# Altium project DIY Air Quality Monitor.PrjPcb
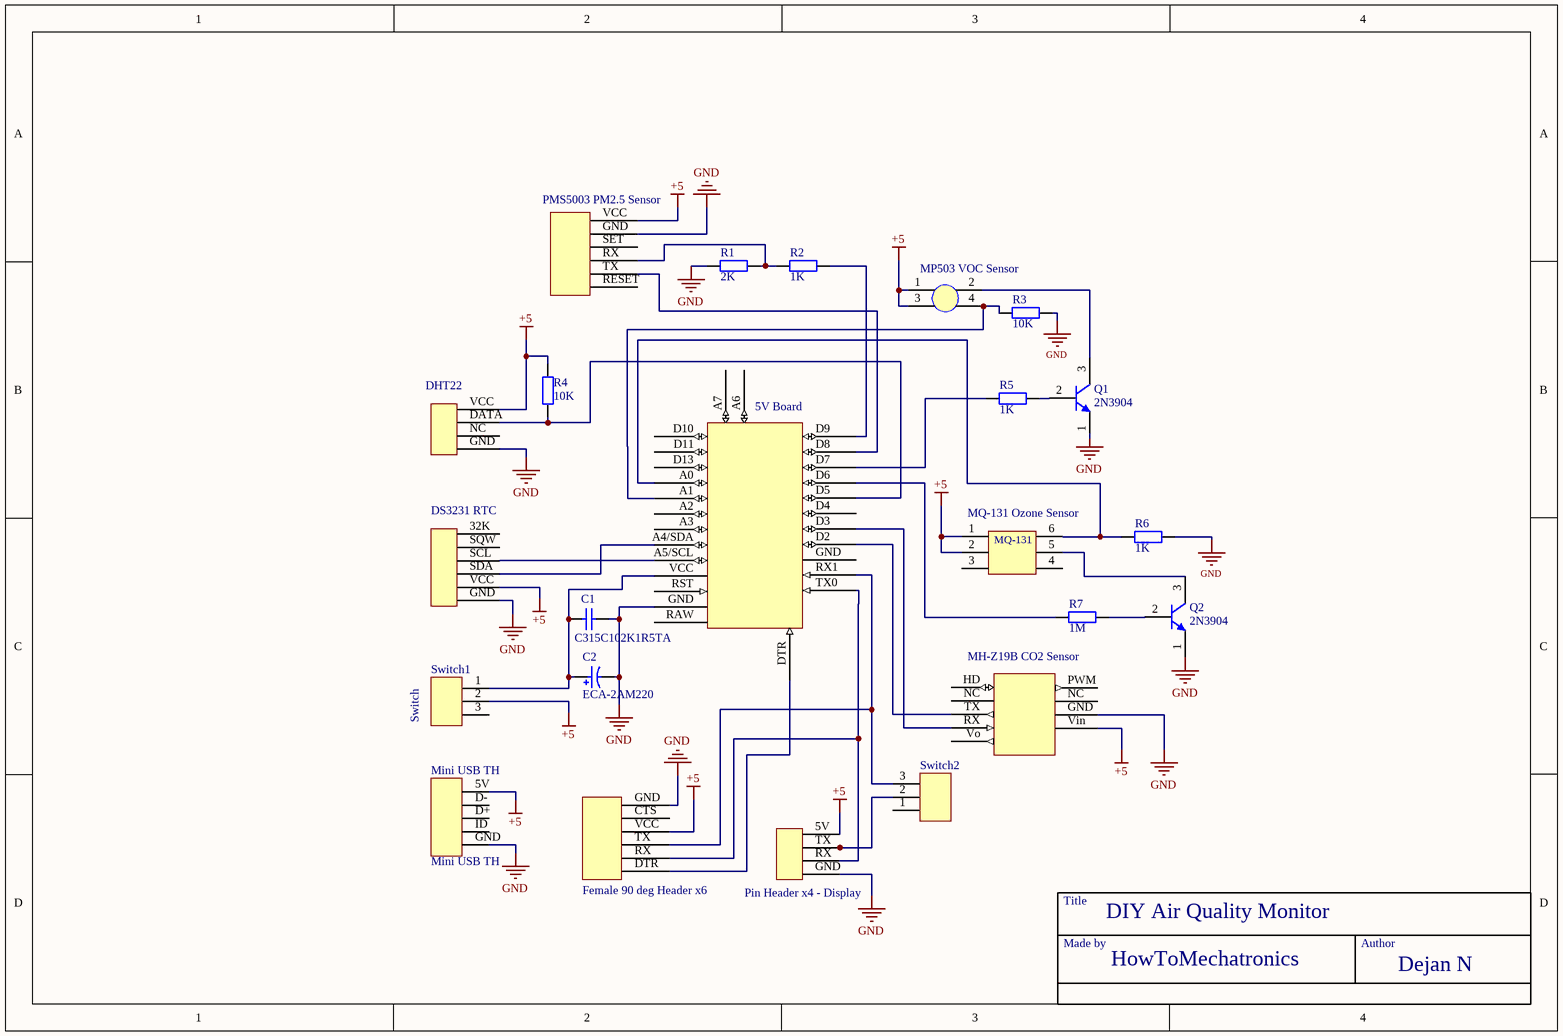
[diagram p0: DIY Air Quality Monitor.SchDoc]
1 sheet, 23 parts. Net scope: global (net labels, ports and power ports of the same name join across sheets).
Board file: DIY Air Quality Monitor.PcbDoc

## Sheet DIY Air Quality Monitor.SchDoc: DIY Air Quality Monitor
size A4; Author: Dejan; Time: DIY Air Quality Monitor

### Parts
ArduinoProMini1  5V Board  [Arduino_Pro_Mini]
C1  C315C102K1R5TA  [KEMT-C315-THT-2]
C2  ECA-2AM220  [CAPPR55-250-1120X630X1220]
DHT22  DHT22  [DHT22]
DS1  DS3231 RTC  [DS3231 RTC]
Female_90_deg_Header_x6  (no value)  [Female 90 deg Header x6]
MH-Z1  MH-Z19B CO2 Sensor  [MH-Z19B CO2 Sensor]
Mini_USB_TH  Mini USB TH  [Mini USB TH]
MP1  MP503 VOC Sensor  [MP503 VOC Sensor]
MQ-1  MQ-131 Ozone Sensor  [MQ-131 Ozone Sensor]
Pin_Header_x4_-_Display  Pin Header x4 - Display  [Pin Header x4 - Display]  (value not drawn)
PMS1  PMS5003 PM2.5 Sensor  [PMS5003 PM2.5 Sensor]
Q1  2N3904  [ONSC-TO-92-3-29-11]
Q2  2N3904  [ONSC-TO-92-3-29-11]
R1  value 2K  [AXIAL-0.4]  (hidden comment: Res2)
R2  value 1K  [AXIAL-0.4]  (hidden comment: Res2)
R3  value 10K  [AXIAL-0.4]  (hidden comment: Res2)
R4  value 10K  [AXIAL-0.4]  (hidden comment: Res2)
R5  value 1K  [AXIAL-0.4]  (hidden comment: Res2)
R6  value 1K  [AXIAL-0.4]  (hidden comment: Res2)
R7  value 1M  [AXIAL-0.4]  (hidden comment: Res2)
Switch1  Switch  [Switch]
Switch2  Switch  [Switch]  (value not drawn)

### Nets
+5: DHT22.VCC DS1.VCC Female_90_deg_Header_x6.VCC MH-Z1.Vin Mini_USB_TH.5V MP1.1 MP1.3 MQ-1.1 MQ-1.2 Pin_Header_x4_-_Display.5V PMS1.VCC R4.2 Switch1.2
GND: ArduinoProMini1.GND C1.2 C2.2 DHT22.GND DS1.GND Female_90_deg_Header_x6.GND MH-Z1.GND Mini_USB_TH.GND Pin_Header_x4_-_Display.GND PMS1.GND Q1.1(E) Q2.1(E) R1.1 R3.2 R6.2
NetArduinoProMini1_A0: ArduinoProMini1.A0 MQ-1.6 R6.1
NetArduinoProMini1_A1: ArduinoProMini1.A1 MP1.4 R3.1
NetArduinoProMini1_A4/SDA: ArduinoProMini1.A4/SDA DS1.SDA
NetArduinoProMini1_A5/SCL: ArduinoProMini1.A5/SCL DS1.SCL
NetArduinoProMini1_D2: ArduinoProMini1.D2 MH-Z1.TX
NetArduinoProMini1_D3: ArduinoProMini1.D3 MH-Z1.RX
NetArduinoProMini1_D5: ArduinoProMini1.D5 DHT22.DATA R4.1
NetArduinoProMini1_D6: ArduinoProMini1.D6 R7.1
NetArduinoProMini1_D7: ArduinoProMini1.D7 R5.1
NetArduinoProMini1_D8: ArduinoProMini1.D8 PMS1.TX
NetArduinoProMini1_D9: ArduinoProMini1.D9 R2.2
NetArduinoProMini1_DTR: ArduinoProMini1.DTR Female_90_deg_Header_x6.DTR
NetArduinoProMini1_RX1: ArduinoProMini1.RX1 Female_90_deg_Header_x6.TX Switch2.3
NetArduinoProMini1_TX0: ArduinoProMini1.TX0 Female_90_deg_Header_x6.RX Pin_Header_x4_-_Display.RX
NetArduinoProMini1_VCC: ArduinoProMini1.VCC C1.1 C2.1 Switch1.1
NetMP1_2: MP1.2 Q1.3(C)
NetMQ-1_5: MQ-1.5 Q2.3(C)
NetPin_Header_x4_-_Display_TX: Pin_Header_x4_-_Display.TX Switch2.2
NetPMS1_RX: PMS1.RX R1.2 R2.1
NetQ1_2: Q1.2(B) R5.2
NetQ2_2: Q2.2(B) R7.2

Not connected (* = marked no-connect by the designer): ArduinoProMini1 A2 A3 A6 A7 D4 D10 D11 D13 RAW RST; DHT22 NC; DS1 32K SQW; Female_90_deg_Header_x6 CTS; MH-Z1 HD NC PWM Vo; Mini_USB_TH D+ D- ID; MQ-1 3 4; PMS1 RESET SET; Switch1 3; Switch2 1

### Notes on the sheet
- Title
- DIY Air Quality Monitor
- Made by
- HowToMechatronics
- Author
- Dejan N
- (in symbol MQ-131 Ozone Sensor) MQ-131

### Library data of the parts
ArduinoProMini1 = Arduino Pro Mini Board
C1 = CMP-1664-00010-1: Capacitor, Ceramic, 1000 pF, +/-10 %, 100 V, X7R, -55 to 125 degC, 2-Pin THD, RoHS, Bulk; Max Supply Voltage: 3.6 V; Case\Package: DFN; Nominal Supply Voltage: 3 V; Min Supply Voltage: 1.5 V; Interface: Serial; ComponentLink1Description: Manufacturer URL; ComponentLink1URL: http://www.kemet.com/; DatasheetVersion: Aug-16; Max Operating Temperature: 125 degC; REACH SVHC: Unknown; Min Operating Temperature: -40 degC; Radiation Hardening: No; Mount: Surface Mount; Packaging: Tape and Reel; PackageDescription: 2-Pin Through Hole Device, Body 3.81 x 2.54 mm; RoHSCompliant: true; PackageReference: C315-THT-2; ComponentLink2URL: http://capacitoredge.kemet.com/capedge2/DataSheet/Datasheet-C315C102K1R5TA.pdf?pn=C315C102K1R5TA{BULK}; ComponentLink2Description: Datasheet; Pins: 6
C2 = CMP-1665-00035-2: Aluminum Electrolytic Capacitor, 22 uF, +/- 20%, 100 V, -40 to 85 degC, 2-Pin THD, RoHS, Bulk; Nominal Vf: 2.1 V; Luminous Intensity: 2 mcd; Viewing Angle: 130 degrees; Lens Style: Clear; Colour: Orange; Forward Current: 20 mA; Case\Package: 0603; ComponentLink2URL: https://industrial.panasonic.com/cdbs/www-data/pdf/RDF0000/ABA0000C1047.pdf; Height: 1.1 mm; Max Operating Temperature: 85 degC; Width: 0.8 mm; ComponentLink1Description: Manufacturer URL; Min Operating Temperature: -55 degC; Package Quantity: 3000; RoHSCompliant: true; DatasheetVersion: Mar-16; Length: 1.6 mm; ComponentLink1URL: http://www.panasonic.com/; Packaging: Tape and Reel; Case Code (Imperial): 0603; Radiation Hardening: No; ComponentLink2Description: Datasheet; Mount: Surface Mount; PackageDescription: 2-Pin Through Hole Device, Dia 6.3 mm, Body Length 11.2 mm; Pins: 2; PackageReference: Radial; Illumination Colour: Orange; Case Code (Metric): 1608; Forward Voltage: 2.1 V
Female_90_deg_Header_x6 = Female 90 deg Header x6
Q1 Q2 = CMP-2000-05562-1: General Purpose Transistor, NPN Silicon, 200 mA, 60 V, -55 to 150 degC, 3-Pin TO-92, RoHS, Bulk; Manufacturer: ONSemiconductor; Emitter- Base Voltage VEBO: 6V; Maximum Power Dissipation: 625mW; Maximum DC Collector Current: 0.2A; Collector- Emitter Voltage VCEO Max: 40V; Collector- Base Voltage VCBO: 60V; DC Collector/Base Gain hfe Min: 60; Configuration: Single; Collector-Emitter Saturation Voltage: 0.3V; Gain Bandwidth Product fT: 270MHz; Mounting Style: ThroughHole; Package / Case: TO-92-3(TO-226); Mounting Technology: ThroughHole; Minimum Operating Temperature: -65C; Datasheet Version: Rev. 8, 08/2012; Product Category: BipolarTransistors-BJT; Factory Pack Quantity: 5000; Transistor Polarity: NPN; Package Description: 3-Pin Transistor Outline, Body 4.825 x 3.685 mm, Pitch 1.27 mm; RoHS: Details; Datasheet URL: https://datasheet.ciiva.com/4725/2n3903-d-285841-4725808.pdf; Packaging: Bulk; Maximum Operating Temperature: +150C; Package Reference: TO-92-3-29-11; Brand: ONSemiconductor; Manufacturer URL: http://www.onsemi.com/
R1-R7 = Res2: Resistor; Published: 8-Jun-2000; LatestRevisionDate: 17-Jul-2002; LatestRevisionNote: Re-released for DXP Platform.; PackageReference: AXIAL-0.4; Publisher: Altium Limited; PackageDescription: Axial Device, Thru-Hole; 2 Leads; 0.4 in Pin Spacing